# Altium schematic sheet DC-Motor-DRV.SchDoc: DC Motor Driver
size OrCAD A; DocumentNumber: LM-004; Revision: B; SheetNumber: 1; SheetTotal: 4
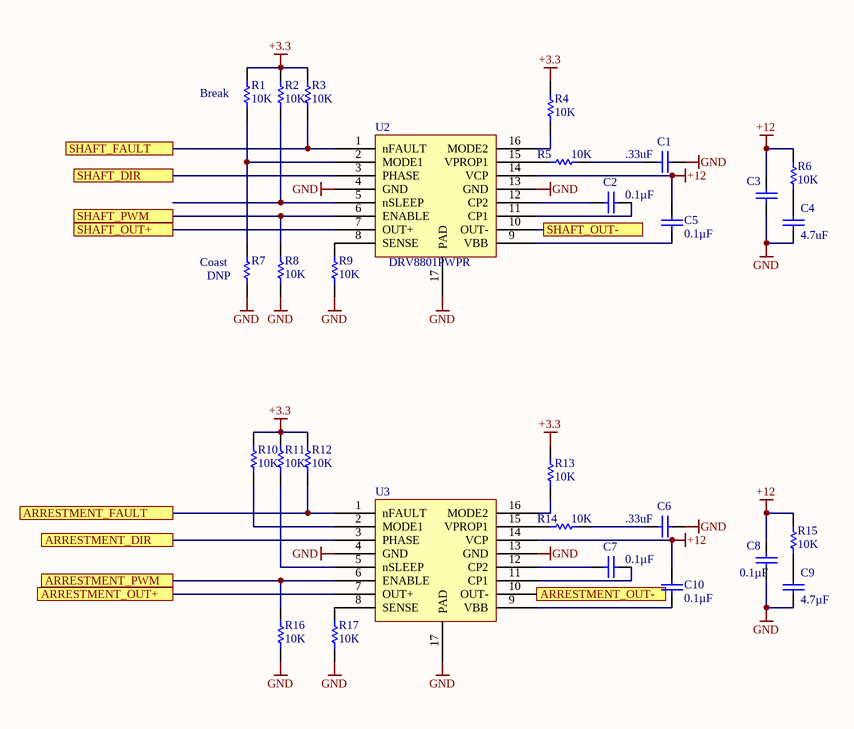
[diagram p0: DC-Motor-DRV.SchDoc]

## Parts
C1  .33uF  [CAPC0805(2012)145_N]
C2  Capacitance: 0.1µF  [CAPC0805(2012)145_N]  (hidden comment: 0.1uF)
C3  0.1uF  [CAPC0805(2012)145_N]  (value not drawn)
C4  4.7uF  [CAPC0805(2012)145_N]
C5  Capacitance: 0.1µF  [CAPC0805(2012)145_N]  (hidden comment: 0.1uF)
C6  .33uF  [CAPC0805(2012)145_N]
C7  Capacitance: 0.1µF  [CAPC0805(2012)145_N]  (hidden comment: CAP CER 0.1UF 25V X7R 0805)
C8  Capacitance: 0.1µF  [CAPC0805(2012)145_N]  (hidden comment: CAP CER 0.1UF 25V X7R 0805)
C9  Capacitance: 4.7µF  [CAPC0805(2012)145_N]  (hidden comment: CAP CER 0.1UF 25V X7R 0805)
C10  Capacitance: 0.1µF  [CAPC0805(2012)145_N]  (hidden comment: CAP CER 0.1UF 25V X7R 0805)
R1  10K  [RESC0805(2012)_L]
R2  10K  [RESC0805(2012)_L]
R3  10K  [RESC0805(2012)_L]
R4  10K  [RESC0805(2012)_L]
R5  10K  [RESC0805(2012)_L]
R6  10K  [RESC0805(2012)_L]
R7  DNP  [RESC0805(2012)_L]
R8  10K  [RESC0805(2012)_L]
R9  10K  [RESC0805(2012)_L]
R10  10K  [RESC0805(2012)_L]
R11  10K  [RESC0805(2012)_L]
R12  10K  [RESC0805(2012)_L]
R13  10K  [RESC0805(2012)_L]
R14  10K  [RESC0805(2012)_L]
R15  10K  [RESC0805(2012)_L]
R16  10K  [RESC0805(2012)_L]
R17  10K  [RESC0805(2012)_L]
U2  DRV8801PWPR  [DRV8801PWPR]
U3  DRV8801PWPR  [DRV8801PWPR]  (value not drawn)

## Ports
ARRESTMENT_DIR, ARRESTMENT_FAULT, ARRESTMENT_OUT+, ARRESTMENT_OUT-, ARRESTMENT_PWM, SHAFT_DIR, SHAFT_FAULT, SHAFT_OUT+, SHAFT_OUT-, SHAFT_PWM

## Nets
+3.3: R1.1 R2.1 R3.1 R4.1 R10.1 R11.1 R12.1 R13.1
+12: C3.1 C5.2 C8.1 C10.2 R6.1 R15.1 U2.14(VCP) U3.14(VCP)
GND: C1.1 C3.2 C4.2 C6.1 C8.2 C9.2 R7.2 R8.2 R9.2 R16.2 R17.2 U2.4(GND) U2.13(GND) U2.17(PAD) U3.4(GND) U3.13(GND) U3.17(PAD)
ARRESTMENT_DIR: U3.3(PHASE) ; port ARRESTMENT_DIR
ARRESTMENT_FAULT: R12.2 U3.1(nFAULT) ; port ARRESTMENT_FAULT
ARRESTMENT_OUT+: U3.7(OUT+) ; port ARRESTMENT_OUT+
ARRESTMENT_OUT-: U3.10(OUT-) ; port ARRESTMENT_OUT-
ARRESTMENT_PWM: R16.1 U3.6(ENABLE) ; port ARRESTMENT_PWM
SHAFT_DIR: U2.3(PHASE) ; port SHAFT_DIR
SHAFT_FAULT: R3.2 U2.1(nFAULT) ; port SHAFT_FAULT
SHAFT_OUT+: U2.7(OUT+) ; port SHAFT_OUT+
SHAFT_OUT-: U2.10(OUT-) ; port SHAFT_OUT-
SHAFT_PWM: R8.1 U2.6(ENABLE) ; port SHAFT_PWM
NetC1_2: C1.2 R5.1
NetC2_1: C2.1 U2.12(CP2)
NetC2_2: C2.2 U2.11(CP1)
NetC4_1: C4.1 R6.2
NetC5_1: C5.1 U2.9(VBB)
NetC6_2: C6.2 R14.1
NetC7_1: C7.1 U3.12(CP2)
NetC7_2: C7.2 U3.11(CP1)
NetC9_1: C9.1 R15.2
NetC10_1: C10.1 U3.9(VBB)
NetR1_2: R1.2 R7.1 U2.2(MODE1)
NetR2_2: R2.2 U2.5(nSLEEP)
NetR4_2: R4.2 U2.16(MODE2)
NetR5_2: R5.2 U2.15(VPROP1)
NetR9_1: R9.1 U2.8(SENSE)
NetR10_2: R10.2 U3.2(MODE1)
NetR11_2: R11.2 U3.5(nSLEEP)
NetR13_2: R13.2 U3.16(MODE2)
NetR14_2: R14.2 U3.15(VPROP1)
NetR17_1: R17.1 U3.8(SENSE)

## Notes on the sheet
- (near R1) Break
- (near R7) Coast
- Title
- Size:
- Date:
- Orcad A
- Number:
- Time:
- Revision:
- Sheet
- of
- ZLS Corporation
- 7801 North Lamar Blvd.
- Suite E-184
- Austin, Texas 78752  USA
- (512) 453-0288
- File:

## Library data of the parts
C1 C6 = CMP-1036-04795-1: CAP CER 0.1UF 25V X7R 0805; Manufacturer: Wurth Electronics Inc.; Manufacturer Part Number: 885012207069; Tolerance: ±10%; Notification: Current market demand for these product types have resulted in fluctuating and extending lead times. Lead times may differ.; Supplier 1: Digi-Key; Supplier Part Number 1: 732-8058-6-ND; RoHS: RoHS Compliant; Category: Capacitors; Stock 1: 1331; Pricing 1: 1=0.1, 10=0.04, 100=0.0359, 500=0.0318 (USD); Packaging: Digi-Reel®; Part Status: Active; Voltage - Rated: 25V; Temperature Coefficient: X7R; Operating Temperature: -55°C ~ 125°C; Features: -; Ratings: -; Applications: General Purpose; Mounting Type: Surface Mount, MLCC; Package / Case: 0805 (2012 Metric); Size / Dimension: 0.079" L x 0.049" W (2.00mm x 1.25mm); Height - Seated (Max): -; Thickness (Max): 0.035" (0.90mm); Lead Spacing: -; Lead Style: -; ComponentLink1URL: https://katalog.we-online.de/pbs/datasheet/885012207069.pdf; ComponentLink1Description: https://katalog.we-online.de/pbs/datasheet/885012207069.pdf
C2 C5 = CMP-1036-04795-1: CAP CER 0.1UF 25V X7R 0805; Manufacturer: Murata Electronics North America; Manufacturer Part Number: GRM21BR71E104KA01L; Tolerance: ±10%; Supplier 1: Digi-Key; Supplier Part Number 1: 490-1673-6-ND; RoHS: RoHS Compliant; Category: Capacitors; Stock 1: 891652; Pricing 1: 1=0.2, 10=0.145, 100=0.0683, 500=0.04788, 1000=0.03964 (USD); Packaging: Digi-Reel®; Part Status: Active; Voltage - Rated: 25V; Temperature Coefficient: X7R; Operating Temperature: -55°C ~ 125°C; Features: -; Ratings: -; Applications: General Purpose; Mounting Type: Surface Mount, MLCC; Package / Case: 0805 (2012 Metric); Size / Dimension: 0.079" L x 0.049" W (2.00mm x 1.25mm); Height - Seated (Max): -; Thickness (Max): 0.053" (1.35mm); Lead Spacing: -; Lead Style: -; ComponentLink1URL: http://www.murata.com/~/media/webrenewal/support/library/catalog/products/capacitor/mlcc/c02e.ashx; ComponentLink1Description: http://www.murata.com/~/media/webrenewal/support/library/catalog/products/capacitor/mlcc/c02e.ashx
C3 = CMP-1036-04795-1: CAP CER 0.1UF 25V X7R 0805; Manufacturer: Murata Electronics North America; Manufacturer Part Number: GRM21BR71E104KA01L; Capacitance: 0.1µF; Tolerance: ±10%; Supplier 1: Digi-Key; Supplier Part Number 1: 490-1673-6-ND; RoHS: RoHS Compliant; Category: Capacitors; Stock 1: 891652; Pricing 1: 1=0.2, 10=0.145, 100=0.0683, 500=0.04788, 1000=0.03964 (USD); Packaging: Digi-Reel®; Part Status: Active; Voltage - Rated: 25V; Temperature Coefficient: X7R; Operating Temperature: -55°C ~ 125°C; Features: -; Ratings: -; Applications: General Purpose; Mounting Type: Surface Mount, MLCC; Package / Case: 0805 (2012 Metric); Size / Dimension: 0.079" L x 0.049" W (2.00mm x 1.25mm); Height - Seated (Max): -; Thickness (Max): 0.053" (1.35mm); Lead Spacing: -; Lead Style: -; ComponentLink1URL: http://www.murata.com/~/media/webrenewal/support/library/catalog/products/capacitor/mlcc/c02e.ashx; ComponentLink1Description: http://www.murata.com/~/media/webrenewal/support/library/catalog/products/capacitor/mlcc/c02e.ashx
C4 = CMP-1036-04795-1: CAP CER 4.7UF 25V 10% X7R 0805; Manufacturer: Murata Electronics North America; Manufacturer Part Number: GRM21BR71E104KA01L; Capacitance: 4.7µF; Supplier 1: Digi-Key; Supplier Part Number 1: 490-1673-6-ND; RoHS: RoHS Compliant; Category: Capacitors; Stock 1: 891652; Pricing 1: 1=0.2, 10=0.145, 100=0.0683, 500=0.04788, 1000=0.03964 (USD); Packaging: Digi-Reel®; Part Status: Active; Tolerance: ±10%; Voltage - Rated: 25V; Temperature Coefficient: X7R; Operating Temperature: -55°C ~ 125°C; Features: -; Ratings: -; Applications: General Purpose; Mounting Type: Surface Mount, MLCC; Package / Case: 0805 (2012 Metric); Size / Dimension: 0.079" L x 0.049" W (2.00mm x 1.25mm); Height - Seated (Max): -; Thickness (Max): 0.053" (1.35mm); Lead Spacing: -; Lead Style: -; ComponentLink1URL: http://www.murata.com/~/media/webrenewal/support/library/catalog/products/capacitor/mlcc/c02e.ashx; ComponentLink1Description: http://www.murata.com/~/media/webrenewal/support/library/catalog/products/capacitor/mlcc/c02e.ashx
C7 C8 C10 = CMP-1036-04795-1: Manufacturer: Murata Electronics North America; Manufacturer Part Number: GRM21BR71E104KA01L; Tolerance: ±10%; Supplier 1: Digi-Key; Supplier Part Number 1: 490-1673-6-ND; RoHS: RoHS Compliant; Category: Capacitors; Stock 1: 891652; Pricing 1: 1=0.2, 10=0.145, 100=0.0683, 500=0.04788, 1000=0.03964 (USD); Packaging: Digi-Reel®; Part Status: Active; Voltage - Rated: 25V; Temperature Coefficient: X7R; Operating Temperature: -55°C ~ 125°C; Features: -; Ratings: -; Applications: General Purpose; Mounting Type: Surface Mount, MLCC; Package / Case: 0805 (2012 Metric); Size / Dimension: 0.079" L x 0.049" W (2.00mm x 1.25mm); Height - Seated (Max): -; Thickness (Max): 0.053" (1.35mm); Lead Spacing: -; Lead Style: -; ComponentLink1URL: http://www.murata.com/~/media/webrenewal/support/library/catalog/products/capacitor/mlcc/c02e.ashx; ComponentLink1Description: http://www.murata.com/~/media/webrenewal/support/library/catalog/products/capacitor/mlcc/c02e.ashx
C9 = CMP-1036-04795-1: CAP CER 0.47UF 25V X7R 0805; Manufacturer: Murata Electronics North America; Manufacturer Part Number: GRM21BR71E104KA01L; Tolerance: ±10%; Supplier 1: Digi-Key; Supplier Part Number 1: 490-1673-6-ND; RoHS: RoHS Compliant; Category: Capacitors; Stock 1: 891652; Pricing 1: 1=0.2, 10=0.145, 100=0.0683, 500=0.04788, 1000=0.03964 (USD); Packaging: Digi-Reel®; Part Status: Active; Voltage - Rated: 25V; Temperature Coefficient: X7R; Operating Temperature: -55°C ~ 125°C; Features: -; Ratings: -; Applications: General Purpose; Mounting Type: Surface Mount, MLCC; Package / Case: 0805 (2012 Metric); Size / Dimension: 0.079" L x 0.049" W (2.00mm x 1.25mm); Height - Seated (Max): -; Thickness (Max): 0.053" (1.35mm); Lead Spacing: -; Lead Style: -; ComponentLink1URL: http://www.murata.com/~/media/webrenewal/support/library/catalog/products/capacitor/mlcc/c02e.ashx; ComponentLink1Description: http://www.murata.com/~/media/webrenewal/support/library/catalog/products/capacitor/mlcc/c02e.ashx
R1-R5 R7-R14 R16 R17 = CMP-1013-00215-1: RES SMD 10K OHM 1% 1/8W 0805; Manufacturer: Vishay Dale; Manufacturer Part Number: CRCW080510K0FKEA; Power (Watts): 0.125W, 1/8W; Temperature Coefficient: ±100ppm/°C; Supplier 1: Digi-Key; Supplier Part Number 1: 541-10.0KCCT-ND; RoHS: RoHS Compliant; Category: Resistors; Stock 1: 1104982; Pricing 1: 1=0.1, 10=0.055, 100=0.0223, 1000=0.01003, 2500=0.0087 (USD); Packaging: Cut Tape (CT); Part Status: Active; Tolerance: ±1%; Composition: Thick Film; Features: Automotive AEC-Q200; Operating Temperature: -55°C ~ 155°C; Package / Case: 0805 (2012 Metric); Supplier Device Package: 0805; Size / Dimension: 0.079" L x 0.049" W (2.00mm x 1.25mm); Height - Seated (Max): 0.020" (0.50mm); Failure Rate: -; ComponentLink1URL: http://www.vishay.com/docs/20035/dcrcwe3.pdf; ComponentLink1Description: http://www.vishay.com/docs/20035/dcrcwe3.pdf
R6 R15 = CMP-1013-00215-1: RES SMD 1R OHM 1% 1/8W 0805; Manufacturer: Vishay Dale; Manufacturer Part Number: CRCW080510K0FKEA; Power (Watts): 0.125W, 1/8W; Temperature Coefficient: ±100ppm/°C; Supplier 1: Digi-Key; Supplier Part Number 1: 541-10.0KCCT-ND; RoHS: RoHS Compliant; Category: Resistors; Stock 1: 1104982; Pricing 1: 1=0.1, 10=0.055, 100=0.0223, 1000=0.01003, 2500=0.0087 (USD); Packaging: Cut Tape (CT); Part Status: Active; Tolerance: ±1%; Composition: Thick Film; Features: Automotive AEC-Q200; Operating Temperature: -55°C ~ 155°C; Package / Case: 0805 (2012 Metric); Supplier Device Package: 0805; Size / Dimension: 0.079" L x 0.049" W (2.00mm x 1.25mm); Height - Seated (Max): 0.020" (0.50mm); Failure Rate: -; ComponentLink1URL: http://www.vishay.com/docs/20035/dcrcwe3.pdf; ComponentLink1Description: http://www.vishay.com/docs/20035/dcrcwe3.pdf
U2 U3 = DRV8801PWPR: IC MOTOR DRIVER PAR 16HTSSOP; Manufacturer: Texas Instruments; Motor Type - Stepper: Bipolar; Motor Type - AC, DC: Brushed DC; Function: Driver - Fully Integrated, Control and Power Stage; Output Configuration: Half Bridge (2); Interface: Parallel; Current - Output: 2.8A; Voltage - Supply: 8 V ~ 38 V; Supplier 1: Digi-Key; Supplier Part Number 1: 296-25378-1-ND; Manufacturer Part Number: DRV8801PWPR; RoHS: RoHS Compliant; Category: Integrated Circuits (ICs); Stock 1: 44037; Pricing 1: 1=2.11, 10=1.892, 100=1.5204, 500=1.24914, 1000=1.035 (USD); Packaging: Cut Tape (CT); Part Status: Active; Technology: DMOS; Step Resolution: -; Applications: General Purpose; Voltage - Load: 8 V ~ 38 V; Operating Temperature: -40°C ~ 150°C (TJ); Mounting Type: Surface Mount; Package / Case: 16-TSSOP (0.173", 4.40mm Width) Exposed Pad; Supplier Device Package: 16-HTSSOP; Base Part Number: DRV8801; ComponentLink1URL: http://www.ti.com/lit/ds/symlink/drv8801.pdf; ComponentLink1Description: http://www.ti.com/lit/ds/symlink/drv8801.pdf